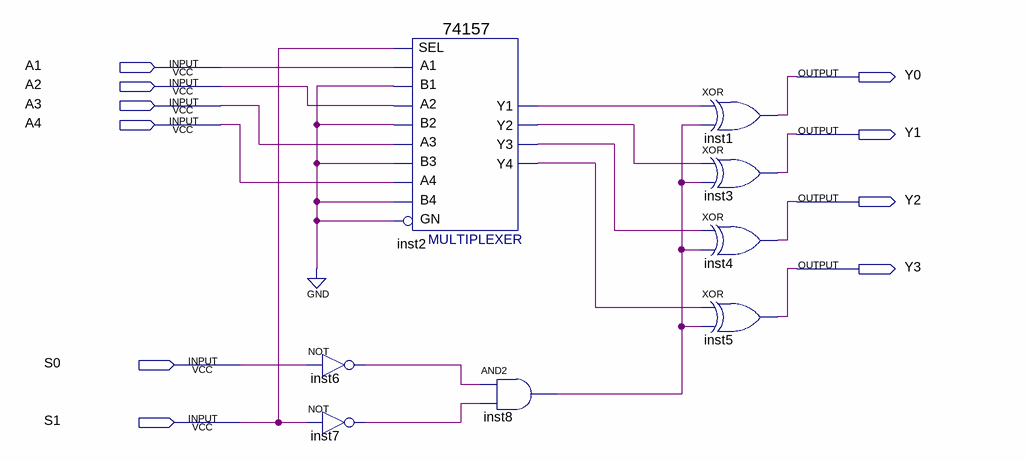
[diagram p0: schematic sheet]
// Quartus schematic BloqueY.bdf as structural Verilog: 8 symbols, 10 pins
module BloqueY (
  input  A1,
  input  A2,
  input  A3,
  input  A4,
  input  S0,
  input  S1,
  output Y0,
  output Y1,
  output Y2,
  output Y3
);

  wire inst2_y1, inst2_y2, inst2_y3, inst2_y4, inst6_out, inst7_out, inst8_out;

  not inst6 (inst6_out, S0);
  not inst7 (inst7_out, S1);
  \74157  inst2 (
    .A1(A1), .B1(1'b0), .SEL(S1), .B2(1'b0), .A3(A3), .B3(1'b0), .A2(A2), .B4(1'b0), .GN(1'b0), .A4(A4),
    .Y2(inst2_y2), .Y1(inst2_y1), .Y4(inst2_y4), .Y3(inst2_y3));
  and inst8 (inst8_out, inst6_out, inst7_out);
  xor inst1 (Y0, inst2_y1, inst8_out);
  xor inst3 (Y1, inst2_y2, inst8_out);
  xor inst4 (Y2, inst2_y3, inst8_out);
  xor inst5 (Y3, inst2_y4, inst8_out);
endmodule
